# EAGLE design HyperArmBoard (EAGLE 9.5.1)
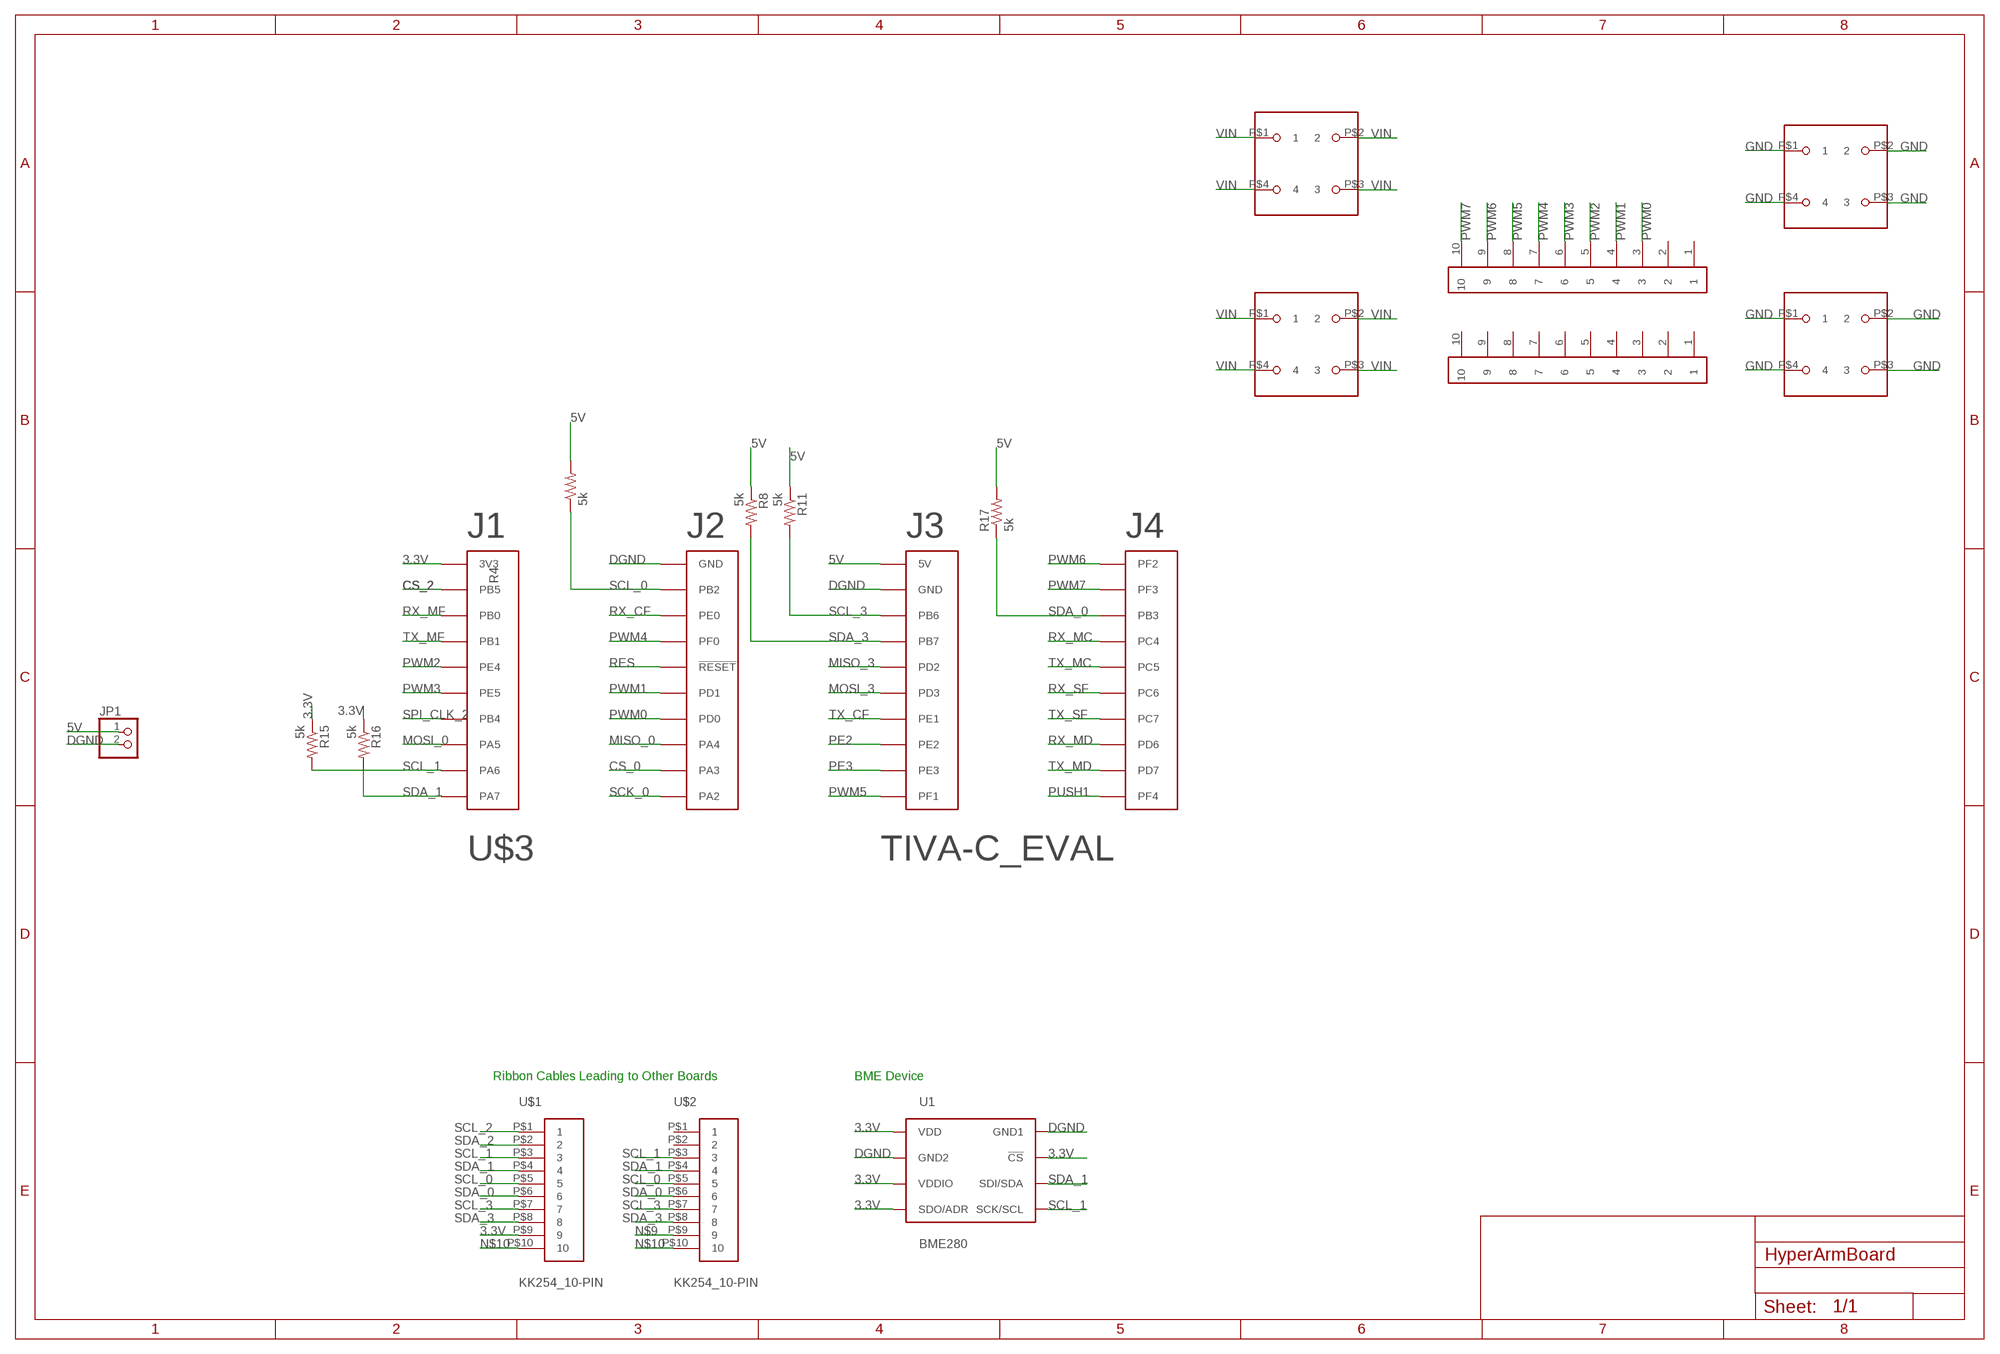
[diagram p0: schematic, sheet 1]

## Parts
JP1  PINHD-1X2  [1X02]
R4  5k  R-US_R0805  [R0805]
R8  5k  R-US_R0805  [R0805]
R11  5k  R-US_R0805  [R0805]
R15  5k  R-US_R0805  [R0805]
R16  5k  R-US_R0805  [R0805]
R17  5k  R-US_R0805  [R0805]
U1  BME280  [BME280_LGA]
U$1  KK254_10-PIN  [KK254_10-PIN]
U$2  KK254_10-PIN  [KK254_10-PIN]
U$3  TIVA-C_EVAL  [TIVA-C_EVAL]
U$4  BCS-106-L-D-PE-BE  [4-PIN-BIGPOWER]
U$5  BCS-106-L-D-PE-BE  [4-PIN-BIGPOWER]
U$6  BCS-106-L-D-PE-BE  [4-PIN-BIGPOWER]
U$7  BCS-106-L-D-PE-BE  [4-PIN-BIGPOWER]
U$10  CONN-RECEPT-2MM-VERT-AU-10POS  [10-PIN-LILPWR]
U$11  CONN-RECEPT-2MM-VERT-AU-10POS  [10-PIN-LILPWR]

## Nets
3.3V: R15.1 R16.1 U1.P$2(!CS) U1.P$5(SDO/ADR) U1.P$6(VDDIO) U1.P$8(VDD) U$1.P$9 U$3.1-1(3V3)
5V: JP1.1 R4.2 R8.1 R11.1 R17.2 U$3.3-1(5V)
CS_0: U$3.2-9(PA3)
CS_2: U$3.1-2(PB5)
DGND: JP1.2 U1.P$1(GND1) U1.P$7(GND2) U$3.2-1(GND) U$3.3-2(GND)
GND: U$6.P$1 U$6.P$2 U$6.P$3 U$6.P$4 U$7.P$1 U$7.P$2 U$7.P$3 U$7.P$4
MISO_0: U$3.2-8(PA4)
MISO_3: U$3.3-5(PD2)
MOSI_0: U$3.1-8(PA5)
MOSI_3: U$3.3-6(PD3)
N$9: U$2.P$9
N$10: U$1.P$10 U$2.P$10
PE2: U$3.3-8(PE2)
PE3: U$3.3-9(PE3)
PUSH1: U$3.4-10(PF4)
PWM0: U$3.2-7(PD0) U$10.3
PWM1: U$3.2-6(PD1) U$10.4
PWM2: U$3.1-5(PE4) U$10.5
PWM3: U$3.1-6(PE5) U$10.6
PWM4: U$3.2-4(PF0) U$10.7
PWM5: U$3.3-10(PF1) U$10.8
PWM6: U$3.4-1(PF2) U$10.9
PWM7: U$3.4-2(PF3) U$10.10
RES: U$3.2-5(!RESET!)
RX_CF: U$3.2-3(PE0)
RX_MC: U$3.4-4(PC4)
RX_MD: U$3.4-8(PD6)
RX_MF: U$3.1-3(PB0)
RX_SF: U$3.4-6(PC6)
SCK_0: U$3.2-10(PA2)
SCL_0: R4.1 U$1.P$5 U$2.P$5 U$3.2-2(PB2)
SCL_1: R15.2 U1.P$4(SCK/SCL) U$1.P$3 U$2.P$3 U$3.1-9(PA6)
SCL_2: U$1.P$1
SCL_3: R11.2 U$1.P$7 U$2.P$7 U$3.3-3(PB6)
SDA_0: R17.1 U$1.P$6 U$2.P$6 U$3.4-3(PB3)
SDA_1: R16.2 U1.P$3(SDI/SDA) U$1.P$4 U$2.P$4 U$3.1-10(PA7)
SDA_2: U$1.P$2
SDA_3: R8.2 U$1.P$8 U$2.P$8 U$3.3-4(PB7)
SPI_CLK_2: U$3.1-7(PB4)
TX_CF: U$3.3-7(PE1)
TX_MC: U$3.4-5(PC5)
TX_MD: U$3.4-9(PD7)
TX_MF: U$3.1-4(PB1)
TX_SF: U$3.4-7(PC7)
VIN: U$4.P$1 U$4.P$2 U$4.P$3 U$4.P$4 U$5.P$1 U$5.P$2 U$5.P$3 U$5.P$4
Unconnected: U$2.P$1 U$2.P$2 U$10.1 U$10.2 U$11.1 U$11.2 U$11.3 U$11.4 U$11.5 U$11.6 U$11.7 U$11.8 U$11.9 U$11.10

## Notes on the sheet
- Ribbon Cables Leading to Other Boards | BME Device

## Library data of the parts
JP1 = pinhead:PINHD-1X2: PIN HEADER
R4 R8 R11 R15-R17 = resistor:R-US_: RESISTOR, American symbol
U1 = BME280ComponentLibrary:BME280; PROD_ID: IC-13090
U$1 U$2 = molex:KK254_10-PIN: KK254 10-pin Datasheet <http://www.molex.com/molex/products/datasheet.jsp?part=active/0022102101_PCB_HEADERS.xml>
U$3 = texas:TIVA-C_EVAL: Texas Instruments Tiva-C TM4C123G LaunchPad Evaluation Board Part number EK-TM4C123GXL Datasheet <http://www.ti.com/lit/ug/spmu296/spmu296.pdf> Microcontroller <http://www.ti.com/lit/ds/spms376e/spms376e.pdf>
U$4-U$7 = samtec:BCS-106-L-D-PE-BE
U$10 U$11 = samtec:CONN-RECEPT-2MM-VERT-AU-10POS

## Board
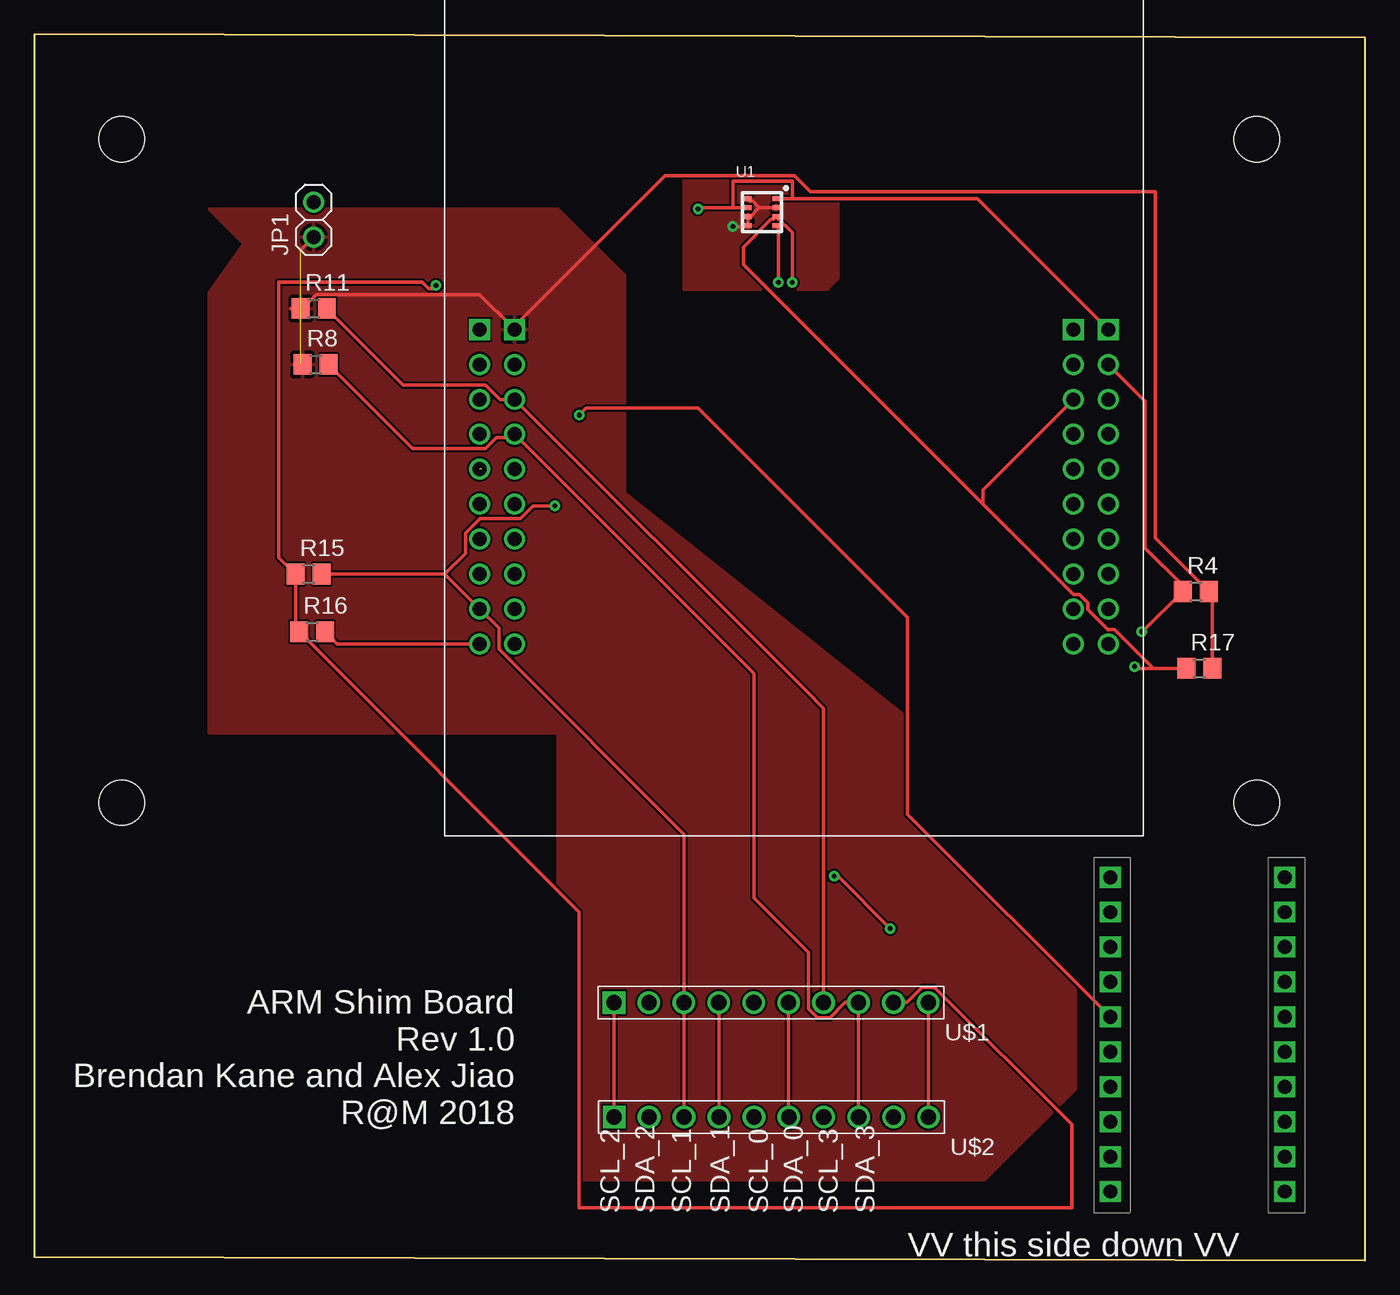
[diagram p1: board, top side]
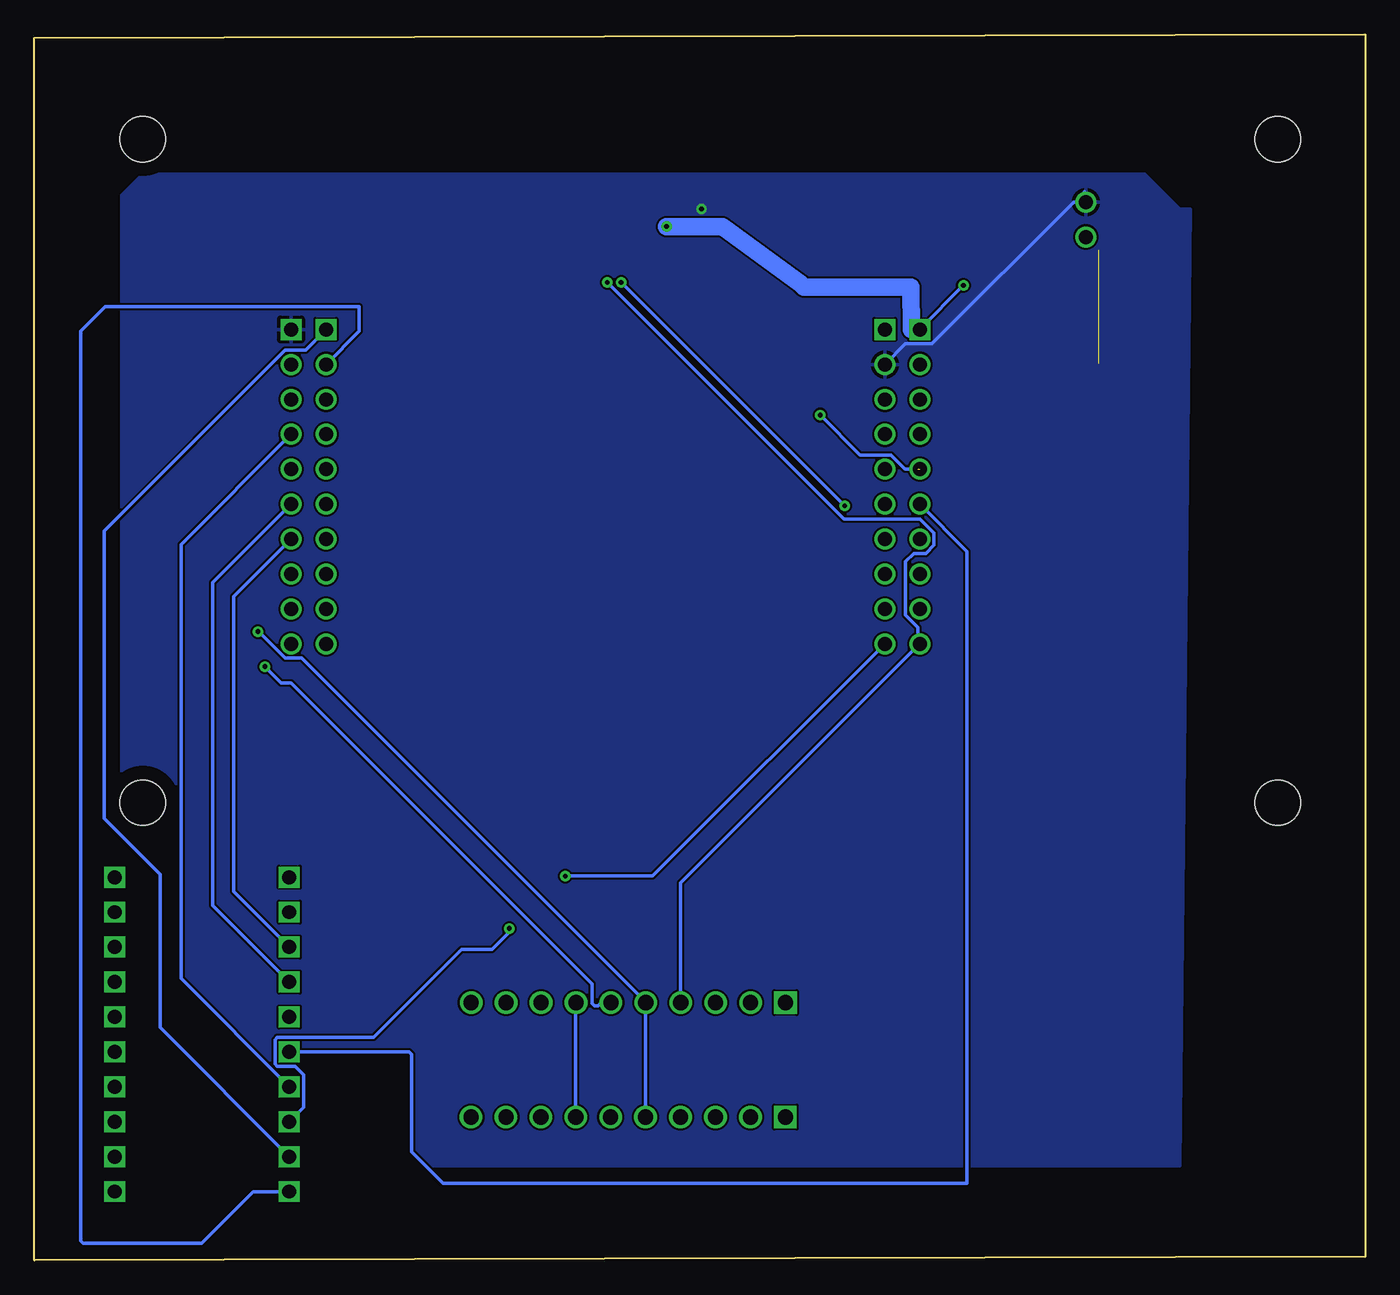
[diagram p2: board, bottom side, seen from below]

Size 96.77 x 89.15 mm. Coordinates in mm from the lower left corner, seen from the top.
Outline: 0,89.15 0,0.25 96.77,0 96.77,88.9 0,89.15
Copper layers (1*16): Top 0.035mm / dielectric 1.5mm / Bottom 0.035mm
Design rules "default": minimum track width 6mil, minimum drill 0.35mm, track to track 6mil, track to pad 6mil, pad to pad 6mil, via to via 6mil, smd to smd 6mil, copper to edge 40mil, drill to drill 6mil, minimum pad ring 10mil, minimum via ring 8mil, stop-mask expansion 4mil, vias tented up to drill 0mil, thermal gap 10mil
Holes 3.3 mm at 6.35,81.53 6.35,33.27 88.9,33.27 88.9,81.53

### Footprints (pad centres in the part's own frame; a part is rotated, then mirrored left to right if it is on the bottom)
1X02 = drill 1.016: 1 -1.27,0; 2 1.27,0
R0805 = smd 1.3 x 1.5: 1 -0.95,0; 2 0.95,0
BME280_LGA = smd 0.5 x 0.35: P$1 1.025,0.975; P$2 1.025,0.325; P$3 1.025,-0.325; P$4 1.025,-0.975; P$5 -1.025,-0.975; P$6 -1.025,-0.325; P$7 -1.025,0.325; P$8 -1.025,0.975
KK254_10-PIN = drill 1.1 square: P$1 11.43,0 | drill 1.1: P$2 8.89,0; P$3 6.35,0; P$4 3.81,0; P$5 1.27,0; P$6 -1.27,0; P$7 -3.81,0; P$8 -6.35,0; P$9 -8.89,0; P$10 -11.43,0
TIVA-C_EVAL = drill 1.016 square: 1-1 -22.86,3.81; 2-1 22.86,3.81; 3-1 -20.32,3.81; 4-1 20.32,3.81 | drill 1.016: 1-2 -22.86,1.27; 1-3 -22.86,-1.27; 1-4 -22.86,-3.81; 1-5 -22.86,-6.35; 1-6 -22.86,-8.89; 1-7 -22.86,-11.43; 1-8 -22.86,-13.97; 1-9 -22.86,-16.51; 1-10 -22.86,-19.05; 2-2 22.86,1.27; 2-3 22.86,-1.27; 2-4 22.86,-3.81; 2-5 22.86,-6.35; 2-6 22.86,-8.89; 2-7 22.86,-11.43; 2-8 22.86,-13.97; 2-9 22.86,-16.51; 2-10 22.86,-19.05; 3-2 -20.32,1.27; 3-3 -20.32,-1.27; 3-4 -20.32,-3.81; 3-5 -20.32,-6.35; 3-6 -20.32,-8.89; 3-7 -20.32,-11.43; 3-8 -20.32,-13.97; 3-9 -20.32,-16.51; 3-10 -20.32,-19.05; 4-2 20.32,1.27; 4-3 20.32,-1.27; 4-4 20.32,-3.81; 4-5 20.32,-6.35; 4-6 20.32,-8.89; 4-7 20.32,-11.43; 4-8 20.32,-13.97; 4-9 20.32,-16.51; 4-10 20.32,-19.05
4-PIN-BIGPOWER = drill 0.762 square: P$1 -1.27,3.81; P$2 1.27,3.81; P$3 1.27,-3.81; P$4 -1.27,-3.81
10-PIN-LILPWR = drill 1.016 square: 1 0,11.35; 2 0,8.81; 3 0,6.27; 4 0,3.73; 5 0,1.19; 6 0,-1.35; 7 0,-3.89; 8 0,-6.43; 9 0,-8.97; 10 0,-11.51

### Placement (x,y rotation side)
JP1  20.32,75.69 90 top
R4  84.45,48.64 0 top
R8  20.45,65.15 0 top
R11  20.32,69.22 0 top
R15  19.94,49.91 0 top
R16  20.19,45.72 0 top
R17  84.71,43.05 0 top
U1  52.91,76.23 0 top
U$1  53.58,18.74 180 top
U$2  53.59,10.41 180 top
U$3  55.24,63.88 0 top
U$4  25.15,-16.76 0 top  (outside the outline)
U$5  37.85,-16.76 0 top  (outside the outline)
U$6  50.55,-16.76 0 top  (outside the outline)
U$7  63.25,-16.76 0 top  (outside the outline)
U$10  78.23,16.51 0 top
U$11  90.93,16.51 0 top

### Tracks (layer width: path | path; a pad name or v marks a point on that pad's centre or on a via)
3.3V  (via drill 0.35)
  Top 0.254: U1.P$5 51.82,75.18 | 51.82,75.18 v50.8,75.18 50.55,75.18 | U1.P$8 52.08,77.01 52.25,77.01 52.71,76.55 | U1.P$2 52.71,76.55 | 52.71,76.55 52.06,75.9 U1.P$6 U1.P$5 51.82,75.18 | U$1.P$9 63.45,18.74 64.55,19.85 65.47,19.85 75.44,9.88 75.44,3.81 39.62,3.81 39.62,25.34 R16.1 18.99,45.97 R15.1 17.78,51.12 17.78,71.12 28.19,71.12 28.66,70.65 28.96,70.65 v29.21,70.9
  Bottom 0.152: 33.08,67.69 33.01,67.69
  Bottom 0.254: v29.21,70.9 32.38,67.73 U$3.1-1
  Bottom 1.27: U$3.1-1 33.01,67.69 33.03,70.76 40.79,70.76 41.05,71.02 46.74,75.18 v50.8,75.18
  pour Top: 47.24,76.2 47.24,70.61 57.66,70.61 58.17,71.12 58.42,71.37 58.42,78.74 57.66,79.5 47.24,79.5
5V  (2 unrouted)
  Top 0.254: 18.99,64.64 19.46,65.12 | 19.46,65.12 R8.1 | 19.37,65.21 19.46,65.12 | 34.8,67.82 32.37,70.24 20.5,70.24 19.48,69.22 R11.1 18.67,69.22 | 34.8,67.82 U$3.3-1 | 19.37,73.47 JP1.1 | 85.41,43.31 R17.2 85.66,48.39 R4.2 81.53,52.51 81.53,77.72 56.45,77.72 55.29,78.89 45.87,78.89 34.8,67.82
  pour Top: 12.7,70.36 12.7,38.35 38.1,38.35 38.1,6.1 38.35,5.84 69.09,5.84 75.69,12.45 75.69,29.72 17.02,76.45
  pour Top: 12.7,76.45 38.1,76.45 42.93,71.63 42.93,55.63 33.53,55.63
DGND  (via drill 0.35)
  Top 0.254: 50.8,76.55 U1.P$7 | 50.8,76.55 50.8,78.49 55.12,78.49 55.12,77.22 | 55.12,77.22 53.95,77.22 U1.P$1 | U$3.2-1 68.58,77.22 55.12,77.22 | 50.8,76.55 48.36,76.55 v48.26,76.45
  Bottom 0.254: U$3.3-2 33.43,66.65 31.51,66.65 21.2,76.96 JP1.2 20.43,77.72
  pour Bottom: 12.7,76.45 13.46,6.86 89.66,6.86 90.42,7.62 90.42,77.47 88.9,78.99 16,78.99 13.46,76.45
GND  (7 unrouted)
N$9
  Top 0.254: 62.47,10.43 U$2.P$9
N$10
  Top 0.254: U$1.P$10 65.01,10.43 U$2.P$10
PWM0
  Bottom 0.254: U$10.3 82.3,26.84 82.3,48.26 U$3.2-7
PWM1
  Bottom 0.254: U$3.2-6 83.82,49.28 83.82,25.83 U$10.4
PWM2  (via drill 0.35)  (1 unrouted)
  Top 0.254: U$10.5 63.5,32.43 63.5,46.74 48.26,61.98 40.13,61.98 v39.62,61.47
  Bottom 0.254: v39.62,61.47 36.73,58.57 34.49,58.57 33.45,57.53 32.54,57.53
PWM3
  Bottom 0.254: U$3.1-6 28.96,51.56 28.96,5.59 67.06,5.59 69.34,7.87 69.34,14.99 69.52,15.16 U$10.6
PWM4
  Bottom 0.254: U$3.2-4 86.11,52.07 86.11,20.49 U$10.7
PWM5  (via drill 0.35)
  Top 0.254: v62.23,24.13 58.42,27.94 v58.17,27.94
  Bottom 0.254: U$10.8 77.19,11.12 77.19,13.5 77.81,14.12 79.11,14.12 79.27,14.28 79.27,16.04 79.11,16.2 72.11,16.2 65.71,22.61 63.5,22.61 62.23,23.88 v62.23,24.13 | v58.17,27.94 51.82,27.94 U$3.3-10
PWM6
  Bottom 0.254: U$3.4-1 77.06,66.19 78.54,66.19 91.69,53.03 91.69,32.12 87.63,28.05 87.63,16.94 U$10.9
PWM7
  Bottom 0.254: U$10.10 80.85,5 84.6,1.25 93.22,1.23 93.39,1.4 93.39,67.56 91.61,69.34 73.15,69.34 73.15,67.56 U$3.4-2
SCL_0  (via drill 0.35)
  Top 0.254: v80.52,45.72 80.58,45.72 R4.1 83.5,49.08 80.77,51.82 80.77,62.48 U$3.2-2
  Bottom 0.254: U$2.P$5 52.32,18.78 52.31,18.8 U$1.P$5 77.36,43.79 78.54,43.79 80.47,45.72 v80.52,45.72
SCL_1  (via drill 0.35)
  Top 0.254: U$1.P$3 47.24,18.73 | U$1.P$3 47.23,10.43 U$2.P$3 | R15.2 29.84,49.91 | 29.84,49.91 U$3.1-9 33.78,45.97 33.78,44.45 47.24,30.99 47.23,30.97 U$1.P$3 | 29.84,49.91 31.34,51.41 31.34,52.88 32.41,53.95 35.36,53.95 36.27,54.86 v37.85,54.86 | v54.1,71.12 54.1,75.09 U1.P$4
  Bottom 0.254: v37.85,54.86 v54.1,71.12 54.36,71.12
SCL_2
  Top 0.254: 42.16,18.73 U$1.P$1 42.15,10.43
SCL_3
  Top 0.254: 57.39,10.43 U$2.P$7 | U$1.P$7 57.39,40.15 56.13,41.4 55.12,42.42 U$3.3-3 33.86,62.61 32.82,63.65 26.83,63.65 R11.2
  Bottom 0.254: U$1.P$7 57.4,18.73 U$2.P$7
SDA_0  (via drill 0.35)
  Top 0.254: 53.74,75.71 53.57,75.71 51.56,73.7 51.56,72.39 68.96,54.99 | 68.96,54.99 75.54,48.41 76,48.41 76.61,47.8 76.61,47.35 78.08,45.87 | 78.08,45.87 78.11,45.85 | U$1.P$6 54.85,10.43 U$2.P$6 | 78.08,45.87 78.54,45.87 81.36,43.05 | 81.36,43.05 R17.1 | 81.36,43.05 80.14,43.05 v80.01,43.18 | U$3.4-3 68.96,56.01 68.96,54.99
  Bottom 0.254: U$1.P$6 55.52,18.74 55.78,18.49 56.03,18.49 56.21,18.67 56.21,20.1 78.11,42 78.83,42 v80.01,43.18 | 54.85,10.43 U$2.P$6
SDA_1  (via drill 0.35)
  Top 0.254: 49.77,11.19 49.78,11.18 U$2.P$4 49.78,10.16 49.77,10.17 U$1.P$4 | U$3.1-10 22.03,44.83 R16.2 | U1.P$3 55.12,74.72 v55.12,71.12
  Bottom 0.254: U$1.P$4 49.77,27.45 32.51,44.7 | 32.51,44.7 U$3.1-10 | v55.12,71.12 37.9,53.9 32.36,53.9 31.34,52.88 31.34,52.02 31.95,51.41 32.82,51.41 33.43,50.8 33.43,46.94 32.51,46.02 32.51,44.7
SDA_2
  Top 0.254: 44.7,18.73 U$1.P$2
SDA_3
  Top 0.152: 59.93,10.43 U$2.P$8
  Top 0.254: 35.18,59.82 52.32,42.67 52.32,26.35 56.28,22.39 56.28,18.29 56.93,17.64 57.85,17.64 58.95,18.74 U$1.P$8 59.94,18.73 U$2.P$8 | 35.18,59.82 U$3.3-4 | 35.18,59.82 33.6,59.82 32.82,59.03 27.52,59.03 R8.2
VIN  (7 unrouted)

### Text on the board
tPlace: ARM Shim Board / Rev 1.0 / Brendan Kane and Alex Jiao / R@M 2018 | SCL_2 | SDA_2 | SCL_1 | SDA_1 | SCL_0 | SDA_0 | SCL_3 | SDA_3
tValues: NC | NC
_tsilk: VV this side down VV